# Altium schematic sheet Schematic_motor_driver_v2.SchDoc: Motor Controller
size B; Author: Artem Dementyev; Revision: 2.0
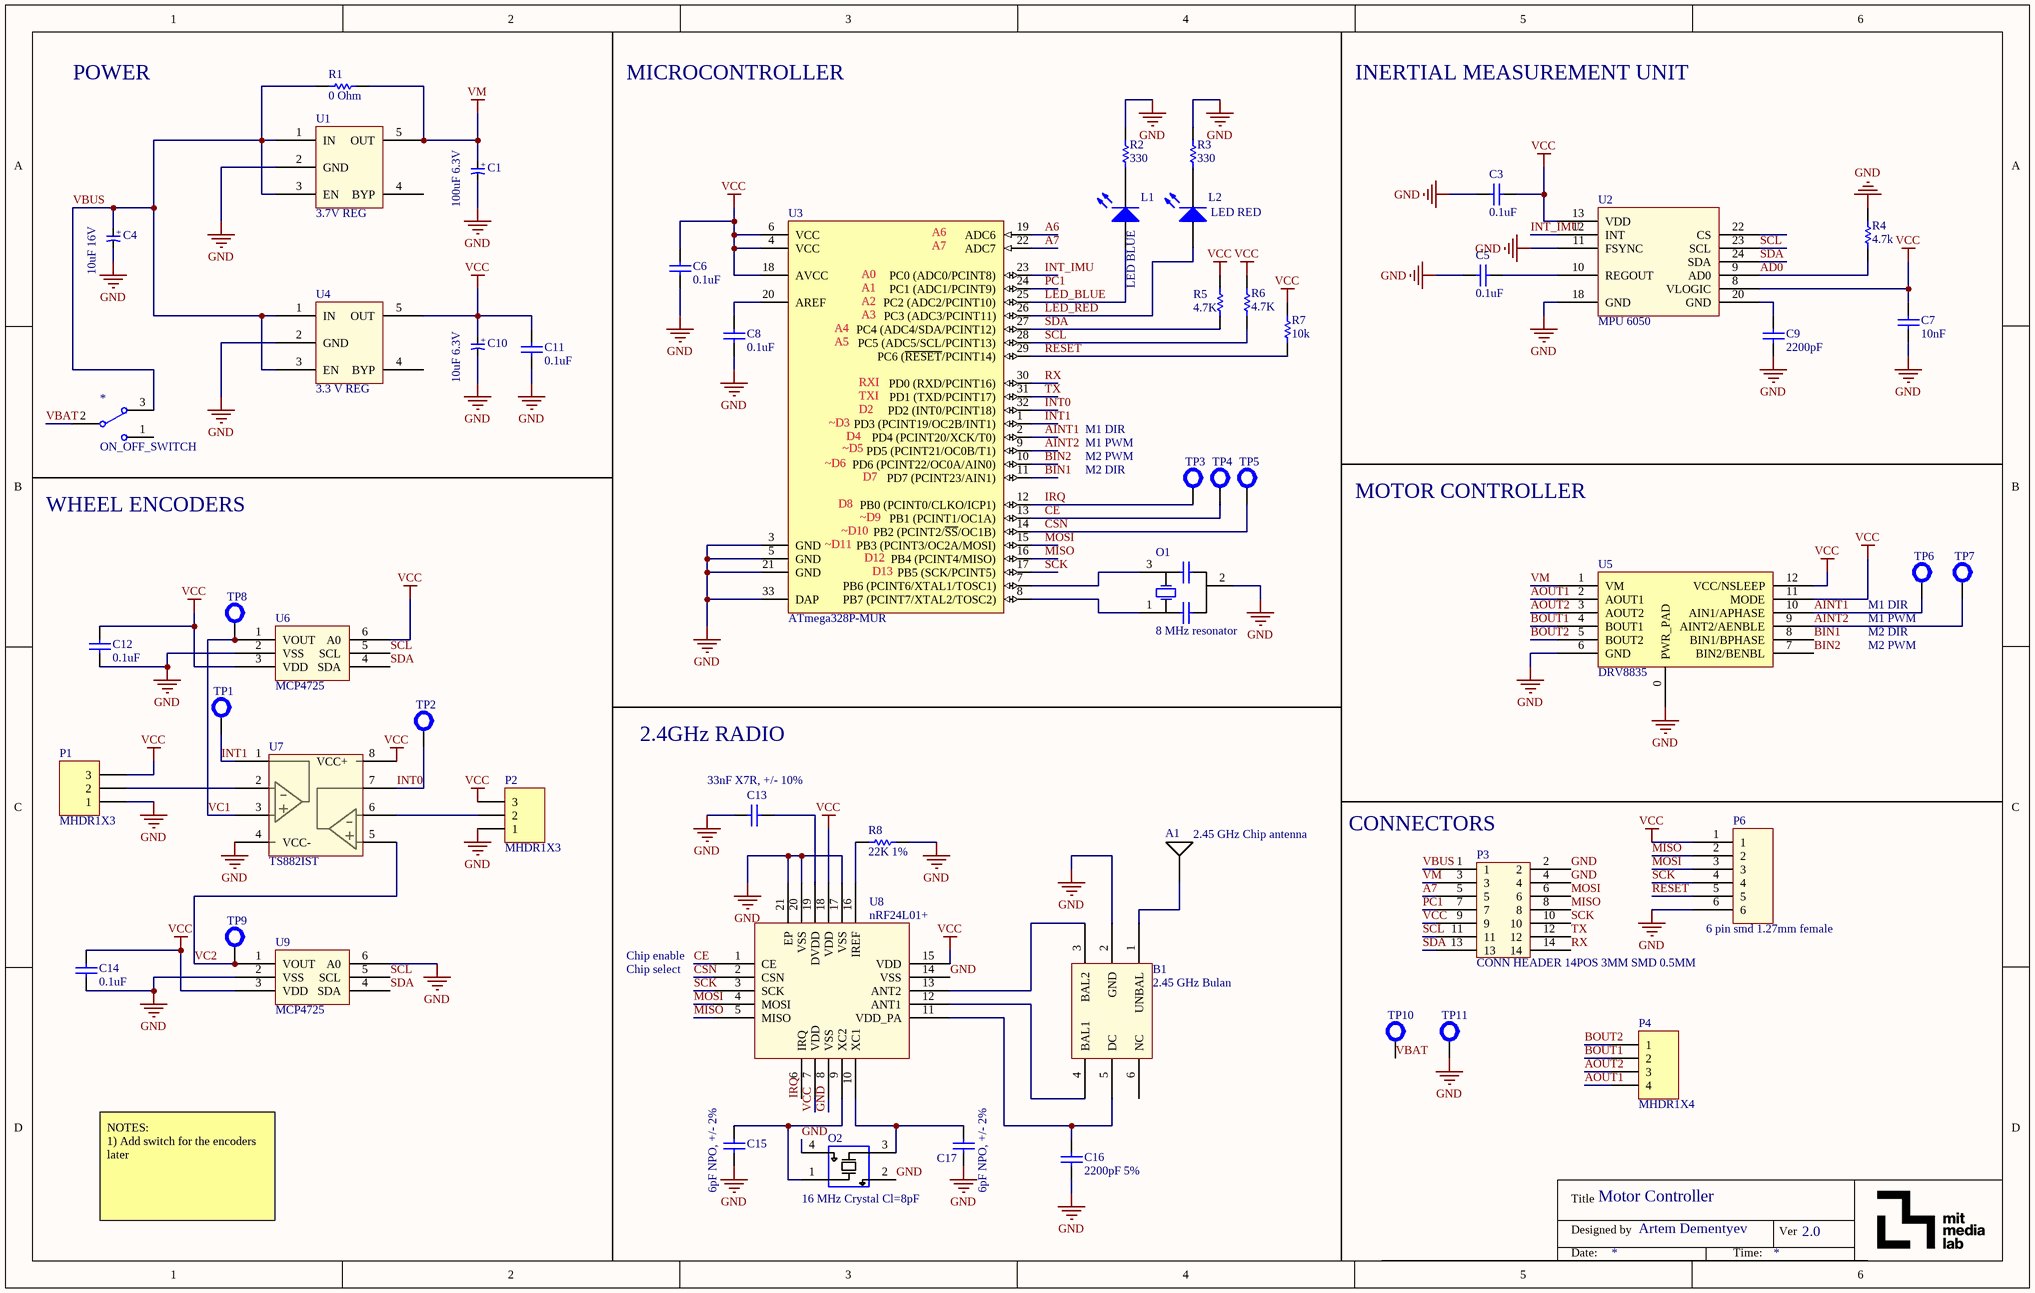
[diagram p0: Schematic_motor_driver_v2.SchDoc]

## Parts
*  ON_OFF_SWITCH  [SWTICH_SMD_SIDE]
A1  2.45 GHz Chip antenna  [2450AT18A100E]
B1  2.45 GHz Bulan  [2450BM14A0002]
C1  100uF 6.3V  [CAP1206]
C3  0.1uF  [0402W]
C4  10uF 16V  [CAP0805]
C5  0.1uF  [0402W]
C6  0.1uF  [0402W]
C7  10nF  [0402W]
C8  0.1uF  [0402W]
C9  2200pF  [0402W]
C10  10uF 6.3V  [0805 TANTALUM]
C11  0.1uF  [0603W]
C12  0.1uF  [0603W]
C13  33nF X7R, +/- 10%  [0402W]
C14  0.1uF  [0603W]
C15  6pF NPO, +/- 2%  [0402W]
C16  2200pF 5%  [0402W]
C17  6pF NPO, +/- 2%  [0402W]
L1  LED BLUE  [0402W]
L2  LED RED  [0402W]
O1  8 MHz resonator  [Resonator SMD]
O2  16 MHz Crystal Cl=8pF  [2.5 x 2.0 crystal]
P1  MHDR1X3  [MHDR1X3]
P2  MHDR1X3  [MHDR1X3]
P3  CONN HEADER 14POS 3MM SMD 0.5MM  [DF12 14Pos]
P4  MHDR1X4  [MHDR1X4]
P6  6 pin smd 1.27mm female  [6pos 1.27mm]
R1  0 Ohm  [0603W]
R2  330  [0402W]
R3  330  [0402W]
R4  4.7k  [0402W]
R5  4.7K  [0402W]
R6  4.7K  [0402W]
R7  10k  [0402W]
R8  22K 1%  [0402W]
TP1  Test point small  [TEST POINT SMD SUPER SMALL]  (value not drawn)
TP2  Test point small  [TEST POINT SMD SUPER SMALL]  (value not drawn)
TP3  Test point small  [TEST POINT SMD SUPER SMALL]  (value not drawn)
TP4  Test point small  [TEST POINT SMD SUPER SMALL]  (value not drawn)
TP5  Test point small  [TEST POINT SMD SUPER SMALL]  (value not drawn)
TP6  Test point small  [TEST POINT SMD SUPER SMALL]  (value not drawn)
TP7  Test point small  [TEST POINT SMD SUPER SMALL]  (value not drawn)
TP8  Test point small  [TEST POINT SMD SUPER SMALL]  (value not drawn)
TP9  Test point small  [TEST POINT SMD SUPER SMALL]  (value not drawn)
TP10  Test point small  [TEST POINT SMD SUPER SMALL]  (value not drawn)
TP11  Test point small  [TEST POINT SMD SUPER SMALL]  (value not drawn)
U1  3.7V REG  [SOT-23-5]
U2  MPU 6050  [QFN24]
U3  ATmega328P-MUR  [32M1-A_M]
U4  3.3 V REG  [SOT-23-5]
U5  DRV8835  [WSON-16]
U6  MCP4725  [SOT23-6]
U7  TS882IST  [MiniS08]
U8  nRF24L01+  [QFN20]
U9  MCP4725  [SOT23-6]

## Nets
GND: B1.2(GND) C1.2 C3.2 C4.2 C5.2 C6.1 C7.2 C8.1 C9.2 C10.2 C11.1 C12.1 C13.2 C14.1 C15.1 C16.1 C17.1 O1.2 O2.2(Gnd) O2.4(Gnd) P1.1 P2.1 P3.2 P3.4 P6.6 R2.1 R3.1 R4.2 R8.1 TP11.0 U1.2(GND) U2.11(FSYNC) U2.18(GND) U3.3(GND) U3.5(GND) U3.21(GND) U3.33(DAP) U4.2(GND) U5.0(PWR_PAD) U5.6(GND) U6.2(VSS) U7.4(VCC-) U8.8(VSS) U8.14(VSS) U8.17(VSS) U8.20(VSS) U8.21(EP) U9.2(VSS) U9.6(A0)
VCC: C3.1 C6.2 C7.1 C10.1 C11.2 C12.2 C14.2 P1.3 P2.3 P3.9 P6.1 R5.2 R6.2 R7.2 U2.8(VLOGIC) U2.13(VDD) U3.4(VCC) U3.6(VCC) U3.18(AVCC) U4.5(OUT) U5.11(MODE) U5.12(VCC/NSLEEP) U6.3(VDD) U6.6(A0) U7.8(VCC+) U8.7(VDD) U8.15(VDD) U8.18(VDD) U9.3(VDD)
VM: C1.1 P3.3 R1.1 U1.5(OUT) U5.1(VM)
A6: U3.19(ADC6)
A7: P3.5 U3.22(ADC7)
AD0: R4.1 U2.9(AD0)
AINT1: TP6.0 U3.2(PD4_(PCINT20/XCK/T0)) U5.10(AIN1/APHASE)
AINT2: TP7.0 U3.9(PD5_(PCINT21/OC0B/T1)) U5.9(AINT2/AENBLE)
AOUT1: P4.4 U5.2(AOUT1)
AOUT2: P4.3 U5.3(AOUT2)
BIN1: U3.11(PD7_(PCINT23/AIN1)) U5.8(BIN1/BPHASE)
BIN2: U3.10(PD6_(PCINT22/OC0A/AIN0)) U5.7(BIN2/BENBL)
BOUT1: P4.2 U5.4(BOUT1)
BOUT2: P4.1 U5.5(BOUT2)
CE: TP4.0 U3.13(PB1_(PCINT1/OC1A)) U8.1(CE)
CSN: TP5.0 U3.14(PB2_(PCINT2/~{SS}/OC1B)) U8.2(CSN)
INT0: TP2.0 U3.32(PD2_(INT0/PCINT18)) U7.7
INT1: TP1.0 U3.1(PD3_(PCINT19/OC2B/INT1)) U7.1
INT_IMU: U2.12(INT) U3.23(PC0_(ADC0/PCINT8))
IRQ: TP3.0 U3.12(PB0_(PCINT0/CLKO/ICP1)) U8.6(IRQ)
LED_BLUE: L1.1(A) U3.25(PC2_(ADC2/PCINT10))
LED_RED: L2.1(A) U3.26(PC3_(ADC3/PCINT11))
MISO: P3.8 P6.2 U3.16(PB4_(PCINT4/MISO)) U8.5(MISO)
MOSI: P3.6 P6.3 U3.15(PB3_(PCINT3/OC2A/MOSI)) U8.4(MOSI)
PC1: P3.7 U3.24(PC1_(ADC1/PCINT9))
RESET: P6.5 R7.1 U3.29(PC6_(~{RESET}/PCINT14))
RX: P3.14 U3.30(PD0_(RXD/PCINT16))
SCK: P3.10 P6.4 U3.17(PB5_(SCK/PCINT5)) U8.3(SCK)
SCL: P3.11 R6.1 U2.23(SCL) U3.28(PC5_(ADC5/SCL/PCINT13)) U6.5(SCL) U9.5(SCL)
SDA: P3.13 R5.1 U2.24(SDA) U3.27(PC4_(ADC4/SDA/PCINT12)) U6.4(SDA) U9.4(SDA)
TX: P3.12 U3.31(PD1_(TXD/PCINT17))
VBAT: *.2 TP10.0
VBUS: *.3 C4.1 P3.1 R1.2 U1.1(IN) U1.3(EN) U4.1(IN) U4.3(EN)
VC1: TP8.0 U6.1(VOUT) U7.3
VC2: TP9.0 U7.5 U9.1(VOUT)
NetA1_1: A1.1 B1.1(UNBAL)
NetB1_3: B1.3(BAL2) U8.13(ANT2)
NetB1_4: B1.4(BAL1) U8.12(ANT1)
NetB1_5: B1.5(DC) C16.2 U8.11(VDD_PA)
NetC5_1: C5.1 U2.10(REGOUT)
NetC8_2: C8.2 U3.20(AREF)
NetC9_1: C9.1 U2.20(GND)
NetC13_1: C13.1 U8.19(DVDD)
NetC15_2: C15.2 O2.1(XIN) U8.9(XC2)
NetC17_2: C17.2 O2.3(XOUT) U8.10(XC1)
NetL1_2: L1.2(K) R2.2
NetL2_2: L2.2(K) R3.2
NetO1_1: O1.1 U3.8(PB7_(PCINT7/XTAL2/TOSC2))
NetO1_3: O1.3 U3.7(PB6_(PCINT6/XTAL1/TOSC1))
NetP1_2: P1.2 U7.2
NetP2_2: P2.2 U7.6
NetR8_2: R8.2 U8.16(IREF)

Not connected (* = marked no-connect by the designer): * 1; B1 6(NC); U1 4(BYP); U2 22(CS); U4 4(BYP)

## Notes on the sheet
- POWER
- MICROCONTROLLER
- INERTIAL MEASUREMENT UNIT
- (near U3) A6
- (near U3) A0
- (near U3) A1
- (near U3) A7
- (near U3) A4
- (near U3) A5
- (near U3) A2
- (near U3) A3
- (near U3) ~D3
- (near U3) D3
- (near U3) RXI
- (near U3) TXI
- (near U3) D2
- M1 DIR
- (near U3) ~D6
- (near U3) D8
- (near U3) ~D5
- (near U3) D4
- (near U3) D7
- M2 PWM
- M2 DIR
- M1 PWM
- MOTOR CONTROLLER
- WHEEL ENCODERS
- (near U3) ~D11
- (near U3) ~D10
- (near U3) ~D9
- (near U3) D12
- (near U3) D13
- (near TP6) M1 PWM
- (near TP6) M1 DIR
- 2.4GHz RADIO
- (near P3) CONNECTORS
- Chip enable
- Chip select
- NOTES:
  1) Add switch for the encoders later
- Title
- Designed by
- Ver
- Date:
- Time:
- (in symbol Capacitor_pol) +

## Library data of the parts
* = ON_OFF_SWITCH: SPDT SMD Side Switch; Sparkfun#: COM-00597; digikey number: 563-1102-1-ND
A1 = 2.45 GHz Chip antenna: for Bluetooth; digikey number: 712-1005-1-ND
B1 = 2.45 GHz Bulan: for nRF8001 chip; digikey number: 712-1574-1-ND
C1 C4 C10 = Capacitor_pol: Polarised capacitor
  C1: digikey part number 1206: 718-1920-1-ND; digikey part numbe 0805: 478-6613-2-ND
  C4: digikey part number: 478-8654-1-ND
  C10: digikey part number: 478-9265-1-ND
C3 C5-C9 C11-C17 = Capacitor: SMD Cap 1206
  C3 C5 C7 C9: digikey number: 587-3383-1-ND
  C6 C8 C12-C14: digikey number: 490-1532-1-ND
  C15 C17: digikey number: 490-8223-1-ND
  C16: digikey number: 399-8957-1-ND
L1 L2 = LED: LED SMD 1206/0603; Sparkfun green: PRT-12622; Sparkfun blue: PRT-12620
O1 = Resonator SMD: Build in caps; digikey number: 490-1195-1-ND
O2 = 16 MHz Crystal Wireless: For BLE use; digikey number: 644-1169-1-ND
P1 P2 = MHDR1X3: Header, 3-Pin; LatestRevisionDate: 17-Jul-2002; LatestRevisionNote: Re-released for DXP Platform.; Publisher: Altium Limited
P4 = MHDR1X4: Header, 4-Pin; LatestRevisionDate: 17-Jul-2002; LatestRevisionNote: Re-released for DXP Platform.; Publisher: Altium Limited
R1-R8 = Resistor
  R1-R7: digikey number: RMCF0603FT10K0CT-ND
  R8: digikey number: P20.0KLCT-ND
U1 U4 = MIC5205_VOLTAGE_REG: 5V LDO SMD
  U1: digikey number: 576-2770-1-ND
  U4: Sparkfun #: PRT-1125; digikey number: 576-1259-1-ND
U2 = MPU_6500: Gyro / accelerometer combo
U3 = ATmega328P-MUR: 8-bit AVR Microcontroller, 32KB Flash, 1KB EEPROM, 2KB SRAM, 32-pin MLF, Industrial Grade (-40°C to 85°C); digikey number: ATMEGA328P-MURCT-ND
U5 = DRV8835: manufacturer: Texas Instruments; manufacturer part number: DRV8835DSSR; digikey part number: 296-30391-1-ND
U6 U9 = MCP4725: 12bit DAC; digikey part number: MCP4725A0T-E/CHCT-ND
U7 = TS882IST: Rail-to-rail 1.1 V dual comparatpr; digikey part number: 497-13800-1-ND
U8 = nRF24L01+: 2.4 GHz Radio; manufacturer part number: nRF24L01P-R; digikey part number: 1490-1033-1-ND
P3 = CONN HEADER 14POS 3MM SMD 0.5MM: digikey part number: H11701TR-ND
P6 = 6 pin smd 1.27mm female: digikey number: ED90490-ND
TP1-TP11 = Test point small: digikey number: 5000K-ND